# Altium schematic sheet Driver Stage.SchDoc
size A4
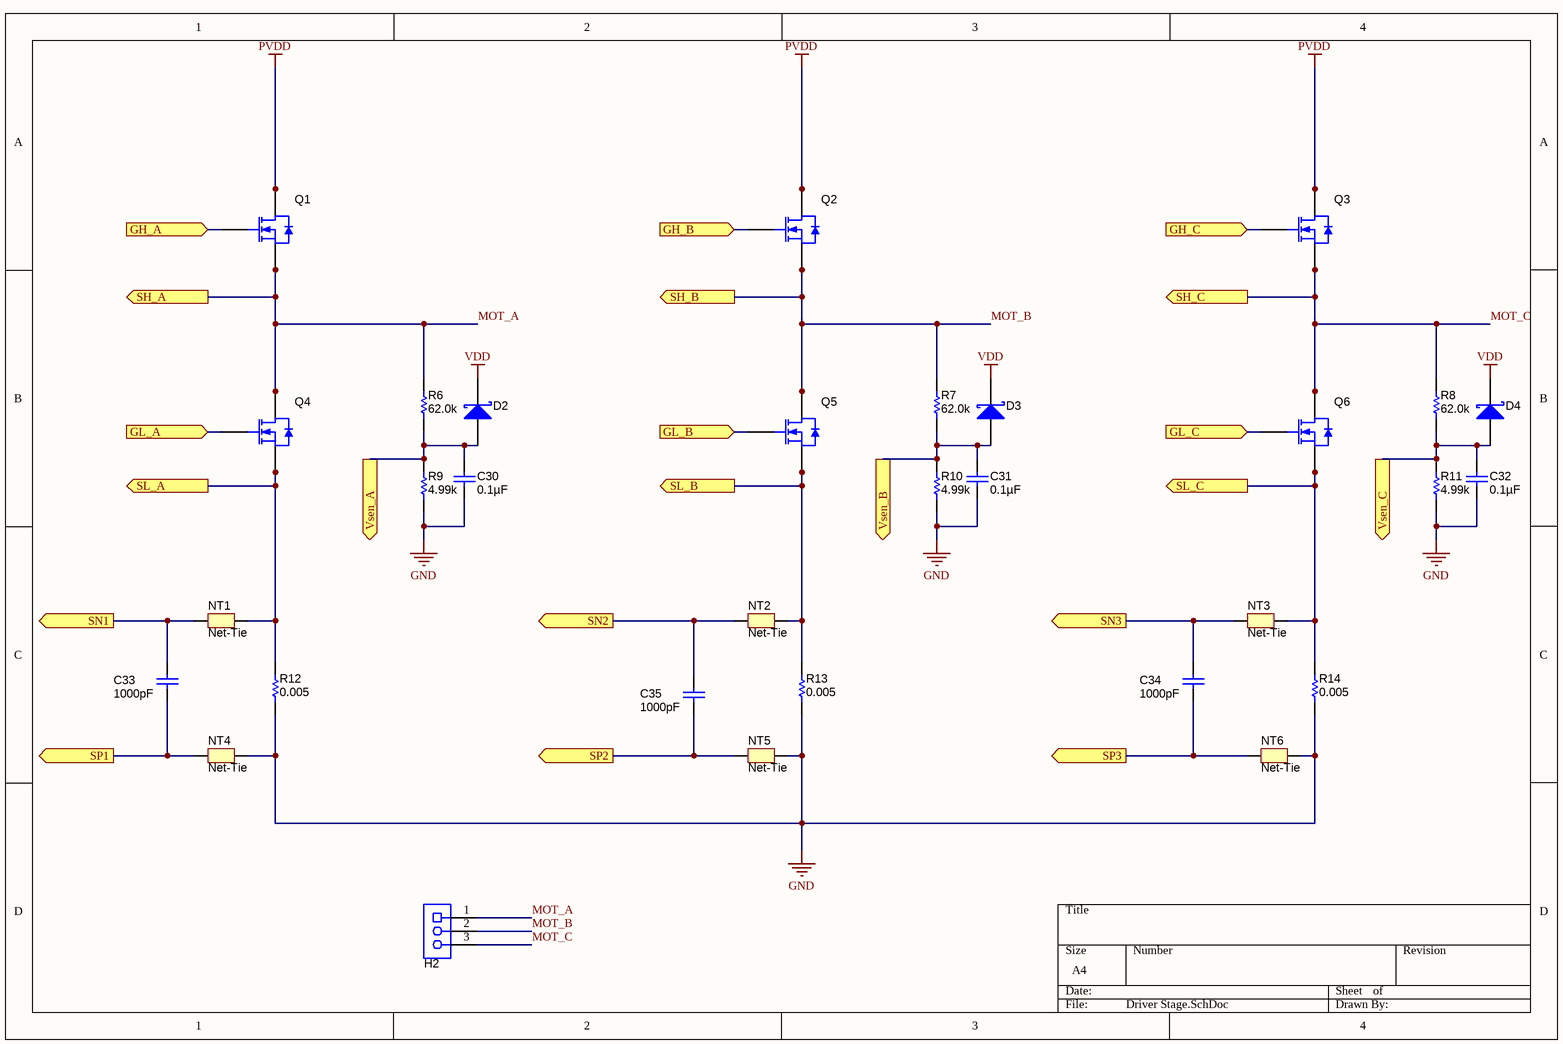
[diagram p0: Driver Stage.SchDoc]

## Parts
C30  ValueDisplayed: 0.1µF  [0603L]  (hidden comment: C0603C104J4RACTU)
C31  ValueDisplayed: 0.1µF  [0603L]  (hidden comment: C0603C104J4RACTU)
C32  ValueDisplayed: 0.1µF  [0603L]  (hidden comment: C0603C104J4RACTU)
C33  ValueDisplayed: 1000pF  [0603L]  (hidden comment: GRM188R71C102KA01D)
C34  ValueDisplayed: 1000pF  [0603L]  (hidden comment: GRM188R71C102KA01D)
C35  ValueDisplayed: 1000pF  [0603L]  (hidden comment: GRM188R71C102KA01D)
D2  CD0603-B0130L  [Diode_0603]  (value not drawn)
D3  CD0603-B0130L  [Diode_0603]  (value not drawn)
D4  CD0603-B0130L  [Diode_0603]  (value not drawn)
H2  OSTT7032150  [On-Shore_OSTT7032150]  (value not drawn)
NT1  Net-Tie  [Net-Tie_10mil]  (net tie, no BOM)
NT2  Net-Tie  [Net-Tie_10mil]  (net tie, no BOM)
NT3  Net-Tie  [Net-Tie_10mil]  (net tie, no BOM)
NT4  Net-Tie  [Net-Tie_10mil]  (net tie, no BOM)
NT5  Net-Tie  [Net-Tie_10mil]  (net tie, no BOM)
NT6  Net-Tie  [Net-Tie_10mil]  (net tie, no BOM)
Q1  CSD18540Q5B  [TRANS_NexFET_Q5B]  (value not drawn)
Q2  CSD18540Q5B  [TRANS_NexFET_Q5B]  (value not drawn)
Q3  CSD18540Q5B  [TRANS_NexFET_Q5B]  (value not drawn)
Q4  CSD18540Q5B  [TRANS_NexFET_Q5B]  (value not drawn)
Q5  CSD18540Q5B  [TRANS_NexFET_Q5B]  (value not drawn)
Q6  CSD18540Q5B  [TRANS_NexFET_Q5B]  (value not drawn)
R6  ValueDisplayed: 62.0k  [0603L]  (hidden comment: RC0603FR-0762KL)
R7  ValueDisplayed: 62.0k  [0603L]  (hidden comment: RC0603FR-0762KL)
R8  ValueDisplayed: 62.0k  [0603L]  (hidden comment: RC0603FR-0762KL)
R9  value 4.99k  [0603L]  (hidden comment: CRCW06034K99FKEA)
R10  value 4.99k  [0603L]  (hidden comment: CRCW06034K99FKEA)
R11  value 4.99k  [0603L]  (hidden comment: CRCW06034K99FKEA)
R12  ValueDisplayed: 0.005  [2512]  (hidden comment: LRMAP2512-R005FT4)
R13  ValueDisplayed: 0.005  [2512]  (hidden comment: LRMAP2512-R005FT4)
R14  ValueDisplayed: 0.005  [2512]  (hidden comment: LRMAP2512-R005FT4)

## Ports
GH_A (in), GH_B (in), GH_C (in), GL_A (in), GL_B (in), GL_C (in), SH_A (out), SH_B (out), SH_C (out), SL_A (out), SL_B (out), SL_C (out), SN1 (out), SN2 (out), SN3 (out), SP1 (out), SP2 (out), SP3 (out), Vsen_A (out), Vsen_B (out), Vsen_C (out)

## Nets
GND: C30.2 C31.2 C32.2 NT4.2 NT5.2 NT6.2 R9.1 R10.1 R11.1 R12.1 R13.1 R14.1
PVDD: Q1.5(D) Q1.6(D) Q1.7(D) Q1.8(D) Q2.5(D) Q2.6(D) Q2.7(D) Q2.8(D) Q3.5(D) Q3.6(D) Q3.7(D) Q3.8(D)
VDD: D2.1(K) D3.1(K) D4.1(K)
GH_A: Q1.4(G) ; port GH_A
GH_B: Q2.4(G) ; port GH_B
GH_C: Q3.4(G) ; port GH_C
GL_A: Q4.4(G) ; port GL_A
GL_B: Q5.4(G) ; port GL_B
GL_C: Q6.4(G) ; port GL_C
MOT_A: H2.1 Q1.1(S) Q1.2(S) Q1.3(S) Q4.5(D) Q4.6(D) Q4.7(D) Q4.8(D) R6.2 ; port SH_A
MOT_B: H2.2 Q2.1(S) Q2.2(S) Q2.3(S) Q5.5(D) Q5.6(D) Q5.7(D) Q5.8(D) R7.2 ; port SH_B
MOT_C: H2.3 Q3.1(S) Q3.2(S) Q3.3(S) Q6.5(D) Q6.6(D) Q6.7(D) Q6.8(D) R8.2 ; port SH_C
SL_A: NT1.2 Q4.1(S) Q4.2(S) Q4.3(S) R12.2 ; port SL_A
SL_B: NT2.2 Q5.1(S) Q5.2(S) Q5.3(S) R13.2 ; port SL_B
SL_C: NT3.2 Q6.1(S) Q6.2(S) Q6.3(S) R14.2 ; port SL_C
SN1: C33.1 NT1.1 ; port SN1
SN2: C35.1 NT2.1 ; port SN2
SN3: C34.1 NT3.1 ; port SN3
SP1: C33.2 NT4.1 ; port SP1
SP2: C35.2 NT5.1 ; port SP2
SP3: C34.2 NT6.1 ; port SP3
Vsen_A: C30.1 D2.2(A) R6.1 R9.2 ; port Vsen_A
Vsen_B: C31.1 D3.2(A) R7.1 R10.2 ; port Vsen_B
Vsen_C: C32.1 D4.2(A) R8.1 R11.2 ; port Vsen_C

## Library data of the parts
C30-C32 = C0603C104J4RACTU: CAP, CERM, 0.1 µF, 16 V, +/- 5%, X7R, 0603; Manufacturer: Kemet; Polarized: N; CompType: Capacitor; Value: 0.1uF; U/M: EA; Cap_F: 0.0000001; Tolerance_%: 5; Value1: Unknown; VDC_V: 16; Value2: 16V; TaMin_C: -55; TaMax_C: 125; Cap_Case: 0603; AEC Category: Q200; SymbolVersion: 2008-07-09; PartNumber: C0603C104J4RACTU; PackageReference: 0603; RoHS: Y; MountType: SMT; Technology: Ceramic; TempCo: X7R; Published: 2008-06-19; Publisher: Texas Instruments; LatestRevisionDate: 2015-12-04; ComponentLink1Description: Datasheet link; ComponentLink1URL: http://www.kemet.com/kemet/web/homepage/kechome.nsf/vapubfiles/F3102_Y5V.pdf/$file/F3102_Y5V.pdf; Supplier 1: Digi-Key; Supplier Part Number 1: 399-1097-1-ND; Supplier 2: Mouser; Supplier Part Number 2: 80-C0603C104J4R; Supplier 3: Farnell; Supplier Part Number 3: 1650834; AEC Qualified: ?
C33-C35 = GRM188R71C102KA01D: CAP, CERM, 1000 pF, 16 V, +/- 10%, X7R, 0603; Manufacturer: MuRata; Polarized: N; CompType: Capacitor; Value: 1000pF; U/M: EA; Cap_F: 0.000000001; Tolerance_%: 10; Value1: Unknown; VDC_V: 16; Value2: 16V; TaMin_C: -55; TaMax_C: 125; Cap_Case: 0603; AEC Category: Q200; SymbolVersion: 2008-07-09; PartNumber: GRM188R71C102KA01D; PackageReference: 0603; RoHS: Y; MountType: SMT; Technology: Ceramic; TempCo: X7R; Published: 2008-06-19; Publisher: Texas Instruments; LatestRevisionDate: 2015-12-04; ComponentLink1Description: Datasheet link; ComponentLink1URL: http://search.murata.co.jp/Ceramy/PnsearchViewAction.do?HnOFG=ON&HnNFG=ON&SEL_CNT=50&sLang=en&sKey=GRM188R71C102KA01D&x=9&y=9&search=startwith; Supplier 1: Digi-Key; Supplier Part Number 1: GRM188R71C102KA01D-ND; Supplier 2: Mouser; Supplier Part Number 2: 81-GRM188R71C102KA1D; AEC Qualified: ?
D2-D4 = CD0603-B0130L: Diode, Schottky, 35 V, 0.1 A, 0603 Diode; Manufacturer: Bourns; Value: 35V; U/M: EA; Vf_V: 0.44; Value1: 0.1A; Value2: 0.44V; Io_A: 0.1; Vr_V: 35; TJmax_C: 125; AEC Category: Q101; CompType: Diode; SymbolVersion: 2008-12-08; PartNumber: CD0603-B0130L; PackageReference: 0603 Diode; MountType: SMT; Type: Schottky; RoHS: Y; Published: 2008-06-26; Publisher: Texas Instruments; LatestRevisionDate: 2015-11-30; ComponentLink1Description: Datasheet link; ComponentLink1URL: http://www.bourns.com/pdfs/SBCD0603_1005.pdf; Supplier 1: Mouser; Supplier Part Number 1: 652-CD0603-B0130L; Supplier 2: Farnell; Supplier Part Number 2: 7599572; AEC Qualified: ?
H2 = OSTT7032150: Terminal Block, 3x1, 9.52mm, TH; Manufacturer: On-Shore Technology; SymbolCreator: a0412235; Pitch_mm: 9.52; Gender: Female; Row_Count: 1; ContactFinish: Brass; SymbolVersion: 2013-10-03; PartNumber: OSTT7032150; PackageReference: Terminal Block, 3x1, 9.52mm, TH; CompType: Terminal Block; RoHS: Y; MountType: TH; ComponentLink1Description: Datasheet URL; ComponentLink1URL: http://www.on-shore.com/sites/default/files/manuals/OSTT7XX2150.pdf; Orientation: Vertical; PinCount: 3; Color: Green; Publisher: Texas Instruments; LatestRevisionDate: 2015-12-23; Supplier 1: Digi-Key; Supplier Part Number 1: ED2678-ND
NT1-NT6 = Net-Tie: Single point connection between nets.; SymbolCreator: codlsc; SymbolVersion: 2009-07-01; MountType: SMT; Publisher: Texas Instruments; LatestRevisionDate: 2015-10-18; LatestRevisionNote: Added Alternate PartNumber and Alternate Manufacturer parameters to appropriate components.; PackageReference: N/A
Q1-Q6 = CSD18540Q5B: MOSFET, N-CH, 60 V, 28 A, SON 5x6mm; Manufacturer: Texas Instruments; Alternate Manufacturer: None; U/M: EA; ChType: N; Value: 60V; VdsMax_V: 60; Value1: 0.0033 ohm; Rdson45_ohm: 0.0033; Value2: 41 nC; QgTyp_nC: 41; Vgs_V: 20; IdsMax_A: 28; AEC Category: Q101; SymbolVersion: 2008-07-09; CompType: MOSFET; PartNumber: CSD18540Q5B; PackageReference: SON 5x6mm; RoHS: Y; MountType: SMT; Published: 2008-06-19; Publisher: Texas Instruments; LatestRevisionDate: 2015-12-03; LatestRevisionNote: Added parts.; ComponentLink1Description: Datasheet link; ComponentLink1URL: http://www.ti.com/lit/ds/symlink/csd18540q5b.pdf; AEC Qualified: N
R6-R8 = RC0603FR-0762KL: RES, 62.0 k, 1%, 0.1 W, 0603; Manufacturer: Yageo America; CompType: Resistor; Value: 62.0k; Res_ohm: 62000; Value_Code: 62k0; Tolerance_%: 1; Power_W: 0.1; Value2: 0.1W; VDC_V: 150; TempCo: 200 ppm/C; U/M: EA; AEC Category: Q200; SymbolVersion: 2009-05-29; PartNumber: RC0603FR-0762KL; PackageReference: 0603; RoHS: Y; Value1: 1%; MountType: SMT; Technology: Thick Film; Published: 2008-06-26; Publisher: Texas Instruments; LatestRevisionDate: 2015-11-22; ComponentLink1Description: Datasheet link; ComponentLink1URL: http://www.yageo.com/pdf/Pu-RC0603_51_PbFree_L_2.pdf; Supplier 1: Digi-Key; Supplier Part Number 1: 311-62.0KHRCT-ND; Supplier 2: Mouser; Supplier Part Number 2: 603-RC0603FR-0762KL; AEC Qualified: ?
R9-R11 = CRCW06034K99FKEA: RES, 4.99 k, 1%, 0.1 W, 0603; Manufacturer: Vishay-Dale; CompType: Resistor; Res_ohm: 4990; Value_Code: 4k99; Tolerance_%: 1; Power_W: 0.1; Value2: 0.1W; VDC_V: 75; TempCo: 100 ppm/C; EIA_Code: E96; U/M: EA; AEC Category: Q200; SymbolVersion: 2009-05-29; PartNumber: CRCW06034K99FKEA; PackageReference: 0603; RoHS: Y; Value1: 1%; MountType: SMT; Technology: Thick Film; Published: 2008-06-26; Publisher: Texas Instruments; LatestRevisionDate: 2015-11-22; ComponentLink1Description: Datasheet link; ComponentLink1URL: http://www.vishay.com/docs/20035/dcrcwe3.pdf; Supplier 1: Digi-Key; Supplier Part Number 1: 541-4.99KHCT-ND; Supplier 2: Mouser; Supplier Part Number 2: 71-CRCW0603-4.99K-E3; Supplier 3: Farnell; Supplier Part Number 3: 1652885; ValueDisplayed: 4.99k; AEC Qualified: ?
R12-R14 = PMR100HZPFU5L00: RES SMD 0.005 OHM 1% 3W 2512; Manufacturer: TT Electronics/Welwyn; CompType: Resistor; Value: 0.005; Value_Code: 5L000; Tolerance_%: 1; Power_W: 3; TempCo: 100 ppm/C; U/M: EA; AEC Category: Q200; SymbolVersion: 2009-05-29; PartNumber: LRMAP2512-R005FT4; PackageReference: 2512; RoHS: Y; Res_ohm: 0.005; Value1: 1%; Value2: 3W; MountType: SMT; Technology: Thick Film; Published: 2008-06-26; Publisher: Texas Instruments; LatestRevisionDate: 2015-12-18; ComponentLink1Description: Datasheet link; ComponentLink1URL: http://www.digikey.com/product-detail/en/LRMAP2512-R005FT4/985-1558-1-ND/4021294; Supplier 1: Digi-Key; Supplier Part Number 1: 985-1558-1-ND; AEC Qualified: ?